# Altium schematic sheet MDL_RECEPTOR_IRF_2.SchDoc
size A4
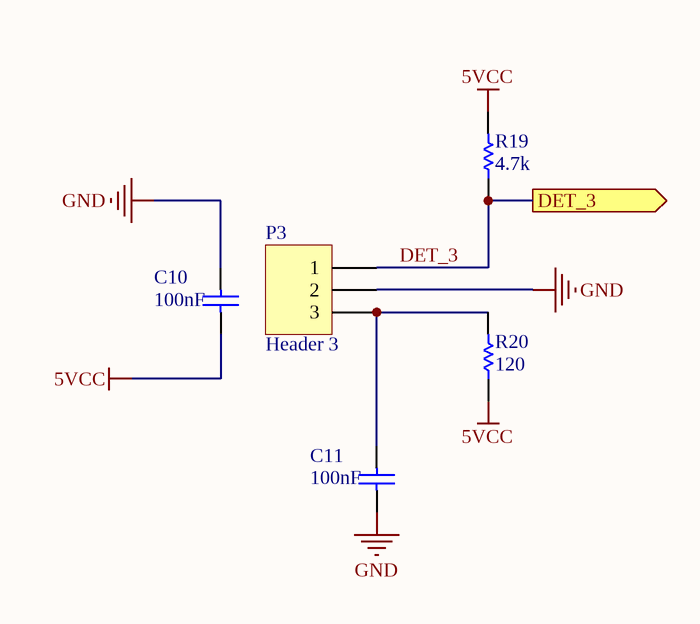
[diagram p0: MDL_RECEPTOR_IRF_2.SchDoc]

## Parts
C10  value 100nF  [VP44-2.5]  (hidden comment: VP44BY224JB)
C11  value 100nF  [VP44-2.5]  (hidden comment: VP44BY224JB)
P3  Header 3  [HDR1X3]
R19  value 4.7k  [AXIAL-0.3]  (hidden comment: Res)
R20  value 120  [AXIAL-0.3]  (hidden comment: Res)

## Ports
DET_3 (out)

## Nets
5VCC: C10.2 R19.2 R20.1
GND: C10.1 C11.2 P3.2
DET_3: P3.1 R19.1 ; port DET_3
NetC11_1: C11.1 P3.3 R20.2

## Library data of the parts
C10 C11 = VP44BY224JB: Dipped Radial Multilayer Ceramic Capacitor X7R: 220nF, 100V; Published: 17-Dec-2003; DatasheetDocument: 4-Feb-2002; PackageDocument: 4-Feb-2002; PackageReference: VP44-2.5; Publisher: Altium Limited; ComponentLink1Description: Manufacturer Link; ComponentLink1URL: http://www.vishay.com/
P3 = Header 3: Header, 3-Pin; LatestRevisionDate: 17-Jul-2002; LatestRevisionNote: Re-released for DXP Platform.; Publisher: Altium Limited
R19 R20 = Res1: Resistor; Published: 8-Jun-2000; LatestRevisionDate: 17-Jul-2002; LatestRevisionNote: Re-released for DXP Platform.; PackageReference: AXIAL-0.3; Publisher: Altium Limited